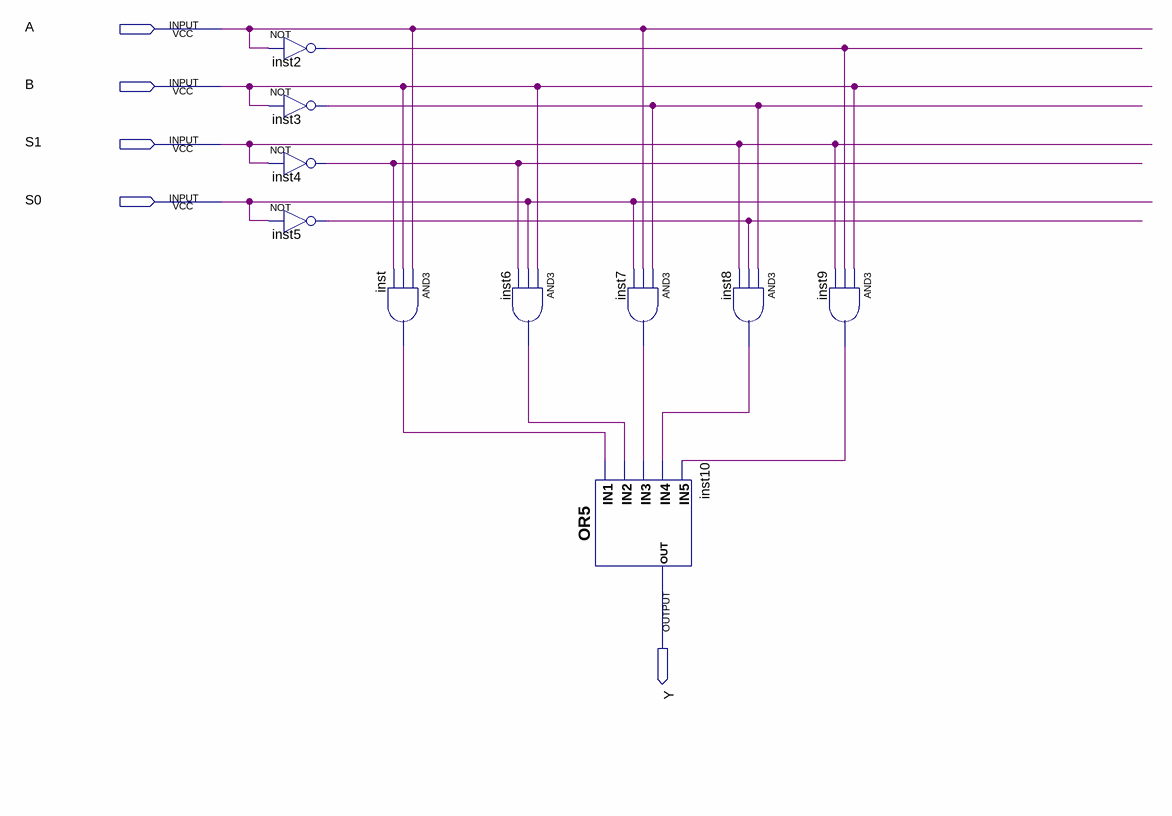
[diagram p0: schematic sheet]
// Quartus schematic LE.bdf as structural Verilog: 10 symbols, 5 pins
module LE (
  input  A,
  input  B,
  input  S1,
  input  S0,
  output Y
);

  wire inst2_out, inst3_out, inst4_out, inst5_out, inst6_out, inst7_out, inst8_out, inst9_out, inst_out;

  not inst2 (inst2_out, A);
  not inst3 (inst3_out, B);
  not inst4 (inst4_out, S1);
  not inst5 (inst5_out, S0);
  and inst (inst_out, A, B, inst4_out);
  and inst6 (inst6_out, B, S0, inst4_out);
  and inst7 (inst7_out, inst3_out, A, S0);
  or inst10 (Y, inst_out, inst6_out, inst7_out, inst8_out, inst9_out);
  and inst8 (inst8_out, inst3_out, inst5_out, S1);
  and inst9 (inst9_out, B, inst2_out, S1);
endmodule
